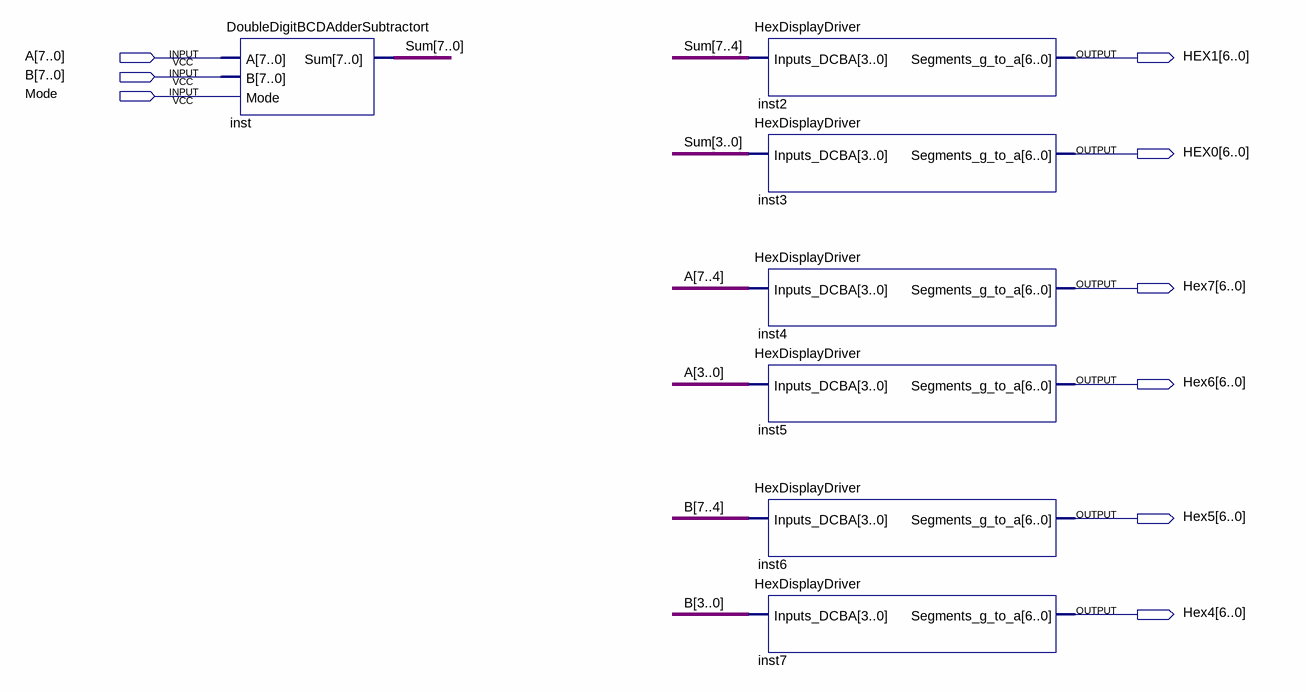
[diagram p0: schematic sheet]
// Quartus schematic BCDAdderSubtractorDisplay.bdf as structural Verilog: 7 symbols, 9 pins
module BCDAdderSubtractorDisplay (
  input  [7:0] A,
  input  [7:0] B,
  input  Mode,
  output [6:0] HEX1,
  output [6:0] HEX0,
  output [6:0] Hex7,
  output [6:0] Hex6,
  output [6:0] Hex5,
  output [6:0] Hex4
);

  wire [7:0] Sum;

  DoubleDigitBCDAdderSubtractort inst (.A(A), .B(B), .Mode(Mode), .Sum(Sum));
  HexDisplayDriver inst2 (.Inputs_DCBA(Sum[7:4]), .Segments_g_to_a(HEX1));
  HexDisplayDriver inst3 (.Inputs_DCBA(Sum[3:0]), .Segments_g_to_a(HEX0));
  HexDisplayDriver inst4 (.Inputs_DCBA(A[7:4]), .Segments_g_to_a(Hex7));
  HexDisplayDriver inst5 (.Inputs_DCBA(A[3:0]), .Segments_g_to_a(Hex6));
  HexDisplayDriver inst6 (.Inputs_DCBA(B[7:4]), .Segments_g_to_a(Hex5));
  HexDisplayDriver inst7 (.Inputs_DCBA(B[3:0]), .Segments_g_to_a(Hex4));
endmodule
